# EAGLE design comparator (EAGLE 6.6.0)
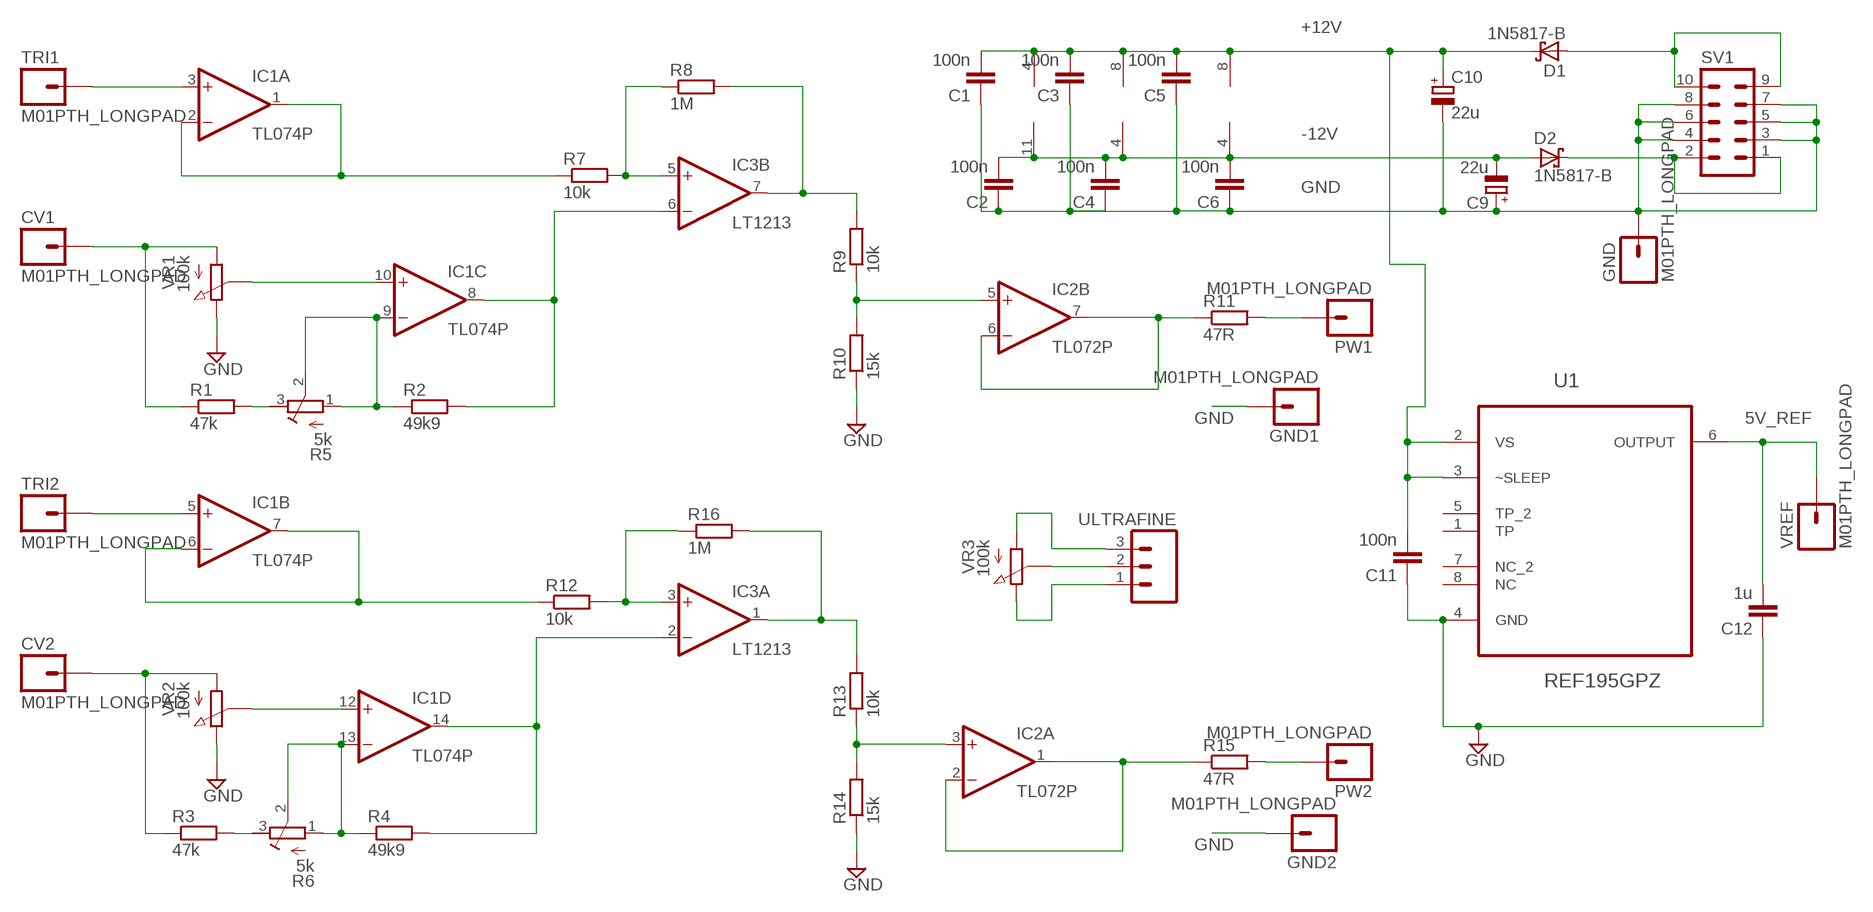
[diagram p0: schematic, sheet 1]

## Parts
C1  100n  C-EU025-025X050  [C025-025X050]
C2  100n  C-EU025-025X050  [C025-025X050]
C3  100n  C-EU025-025X050  [C025-025X050]
C4  100n  C-EU025-025X050  [C025-025X050]
C5  100n  C-EU025-025X050  [C025-025X050]
C6  100n  C-EU025-025X050  [C025-025X050]
C9  22u  CPOL-EUE2.5-5  [E2,5-5]
C10  22u  CPOL-EUE2.5-5  [E2,5-5]
C11  100n  C-EU025-025X050  [C025-025X050]
C12  1u  C-EU050-025X075  [C050-025X075]
CV1  M01PTH_LONGPAD  [1X01_LONGPAD]
CV2  M01PTH_LONGPAD  [1X01_LONGPAD]
D1  1N5817-B  [DO41-7.6]
D2  1N5817-B  [DO41-7.6]
GND  M01PTH_LONGPAD  [1X01_LONGPAD]
GND1  M01PTH_LONGPAD  [1X01_LONGPAD]
GND2  M01PTH_LONGPAD  [1X01_LONGPAD]
IC1  TL074P  [DIL14]
IC2  TL072P  [DIL08]
IC3  LT1213  TL072P  [DIL08]
PW1  M01PTH_LONGPAD  [1X01_LONGPAD]
PW2  M01PTH_LONGPAD  [1X01_LONGPAD]
R1  47k  MULTICOMP_MF25  [02.5-06.8/10]
R2  49k9  MULTICOMP_MF25  [02.5-06.8/10]
R3  47k  MULTICOMP_MF25  [02.5-06.8/10]
R4  49k9  MULTICOMP_MF25  [02.5-06.8/10]
R5  5k  R-TRIMM3296W  [RTRIM3296W]
R6  5k  R-TRIMM3296W  [RTRIM3296W]
R7  10k  MULTICOMP_MF25  [02.5-06.8/10]
R8  1M  MULTICOMP_MF25  [02.5-06.8/10]
R9  10k  MULTICOMP_MF25  [02.5-06.8/10]
R10  15k  MULTICOMP_MF25  [02.5-06.8/10]
R11  47R  MULTICOMP_MF25  [02.5-06.8/10]
R12  10k  MULTICOMP_MF25  [02.5-06.8/10]
R13  10k  MULTICOMP_MF25  [02.5-06.8/10]
R14  15k  MULTICOMP_MF25  [02.5-06.8/10]
R15  47R  MULTICOMP_MF25  [02.5-06.8/10]
R16  1M  MULTICOMP_MF25  [02.5-06.8/10]
SV1  10_PIN_HEADER  [MA05-2]
TRI1  M01PTH_LONGPAD  [1X01_LONGPAD]
TRI2  M01PTH_LONGPAD  [1X01_LONGPAD]
U1  REF195GPZ  [DIP254P762X533-8]
ULTRAFINE  M03LOCK  [1X03_LOCK]
VR1  100k  BI_P09X  [BI_9MM_SIDE]
VR2  100k  BI_P09X  [BI_9MM_SIDE]
VR3  100k  BI_P09X  [BI_9MM_SIDE]
VREF  M01PTH_LONGPAD  [1X01_LONGPAD]

## Nets
5V_REF: C12.2 U1.6(OUTPUT) VREF.1
+12V: C1.2 C3.2 C5.2 C10.+ C11.2 D1.C IC1.4(P:V+) IC2.8(P:V+) IC3.8(P:V+) U1.2(VS) U1.3(~SLEEP)
-12V: C2.2 C4.2 C6.2 C9.- D2.A IC1.11(P:V-) IC2.4(P:V-) IC3.4(P:V-)
GND: C1.1 C2.1 C3.1 C4.1 C5.1 C6.1 C9.+ C10.- C11.1 C12.1 GND1.1 GND2.1 GND.1 R10.P$1 R14.P$1 SV1.3 SV1.4 SV1.5 SV1.6 SV1.7 SV1.8 U1.4(GND) VR1.TOP VR2.TOP
N$1: IC1.3(A:+IN) TRI1.1
N$2: IC1.1(A:OUT) IC1.2(A:-IN) R7.P$1
N$3: IC3.5(B:+IN) R7.P$2 R8.P$1
N$5: PW1.1 R11.P$2
N$6: IC1.10(C:+IN) VR1.WIPER
N$7: R3.P$2 R6.3(A)
N$8: R1.P$2 R5.3(A)
N$9: IC1.9(C:-IN) R2.P$1 R5.1(E) R5.2(S)
N$10: IC1.8(C:OUT) IC3.6(B:-IN) R2.P$2
N$11: IC3.7(B:OUT) R8.P$2 R9.P$2
N$12: IC2.5(B:+IN) R9.P$1 R10.P$2
N$13: IC2.6(B:-IN) IC2.7(B:OUT) R11.P$1
N$14: IC3.3(A:+IN) R12.P$2 R16.P$1
N$15: IC1.5(B:+IN) TRI2.1
N$16: IC1.6(B:-IN) IC1.7(B:OUT) R12.P$1
N$18: IC1.12(D:+IN) VR2.WIPER
N$19: IC1.13(D:-IN) R4.P$1 R6.1(E) R6.2(S)
N$20: IC1.14(D:OUT) IC3.2(A:-IN) R4.P$2
N$21: IC3.1(A:OUT) R13.P$2 R16.P$2
N$22: IC2.3(A:+IN) R13.P$1 R14.P$2
N$23: IC2.1(A:OUT) IC2.2(A:-IN) R15.P$1
N$24: PW2.1 R15.P$2
N$26: ULTRAFINE.3 VR3.BOTTOM
N$27: ULTRAFINE.1 VR3.TOP
N$28: D1.A SV1.9 SV1.10
N$30: ULTRAFINE.2 VR3.WIPER
N$33: D2.C SV1.1 SV1.2
PW_CV1: CV1.1 R1.P$1 VR1.BOTTOM
PW_CV2: CV2.1 R3.P$1 VR2.BOTTOM
Unconnected: U1.1(TP) U1.5(TP_2) U1.7(NC_2) U1.8(NC)

## Library data of the parts
C1-C6 C11 C12 = resistor:C-EU: CAPACITOR, European symbol
C9 C10 = resistor:CPOL-EU: POLARIZED CAPACITOR, European symbol
CV1 CV2 GND GND1 GND2 PW1 PW2 TRI1 TRI2 VREF = SparkFun-Connectors:M01: Header 1 Standard 1-pin 0.1" header. Use with straight break away headers (SKU : PRT-00116), right angle break away headers (PRT-00553), swiss pins (PRT-00743), machine pins (PRT-00117), and female headers (PRT-00115).
D1 D2 = diode:1N581*: 1.0A SCHOTTKY BARRIER RECTIFIER Source: http://www.diodes.com/datasheets/ds23001.pdf
IC1 = linear:TL074: OP AMP
IC2 IC3 = linear:TL072: OP AMP
R1-R4 R7-R16 = resistors:MULTICOMP_MF25
R5 R6 = resistor:R-TRIMM: Trimm resistor
SV1 = TomW:10_PIN_HEADER: PIN HEADER; OC_FARNELL: unknown; OC_NEWARK: unknown
U1 = Vrefs:REF195GPZ: Precision Micropower Low Dropout Voltage References; MPN: REF195GPZ; OC_FARNELL: 1438681; OC_NEWARK: 19M9001; PACKAGE: PDIP-8; SUPPLIER: Analog Devices
ULTRAFINE = SparkFun-Connectors:M03: Header 3 Standard 3-pin 0.1" header. Use with straight break away headers (SKU : PRT-00116), right angle break away headers (PRT-00553), swiss pins (PRT-00743), machine pins (PRT-00117), and female headers (PRT-00115). Molex polarized connector foot print use with SKU : PRT-08232 with associated crimp pins and housings.
VR1-VR3 = potentiometers:BI_P09X: BI 9mm conductive plastic potentiometer right angled, single gang, 6mm shaft, bushing Mouser Part No: 858-P0915NEC15BR100K Manufacturer Part No: P0915N-EC15BR100K

## Board
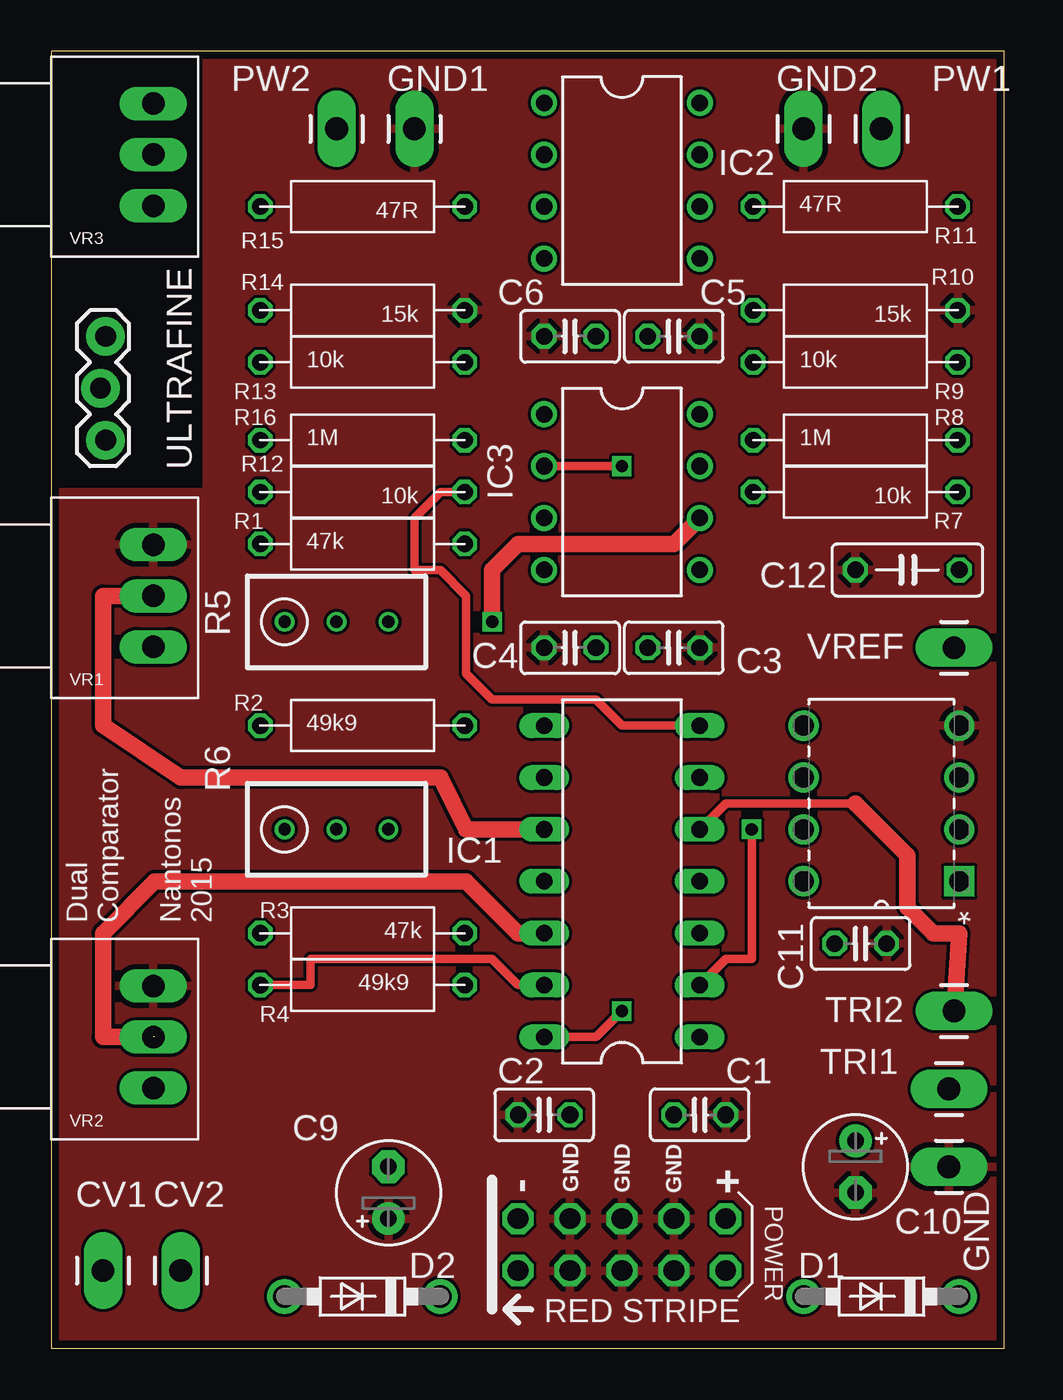
[diagram p1: board, top side]
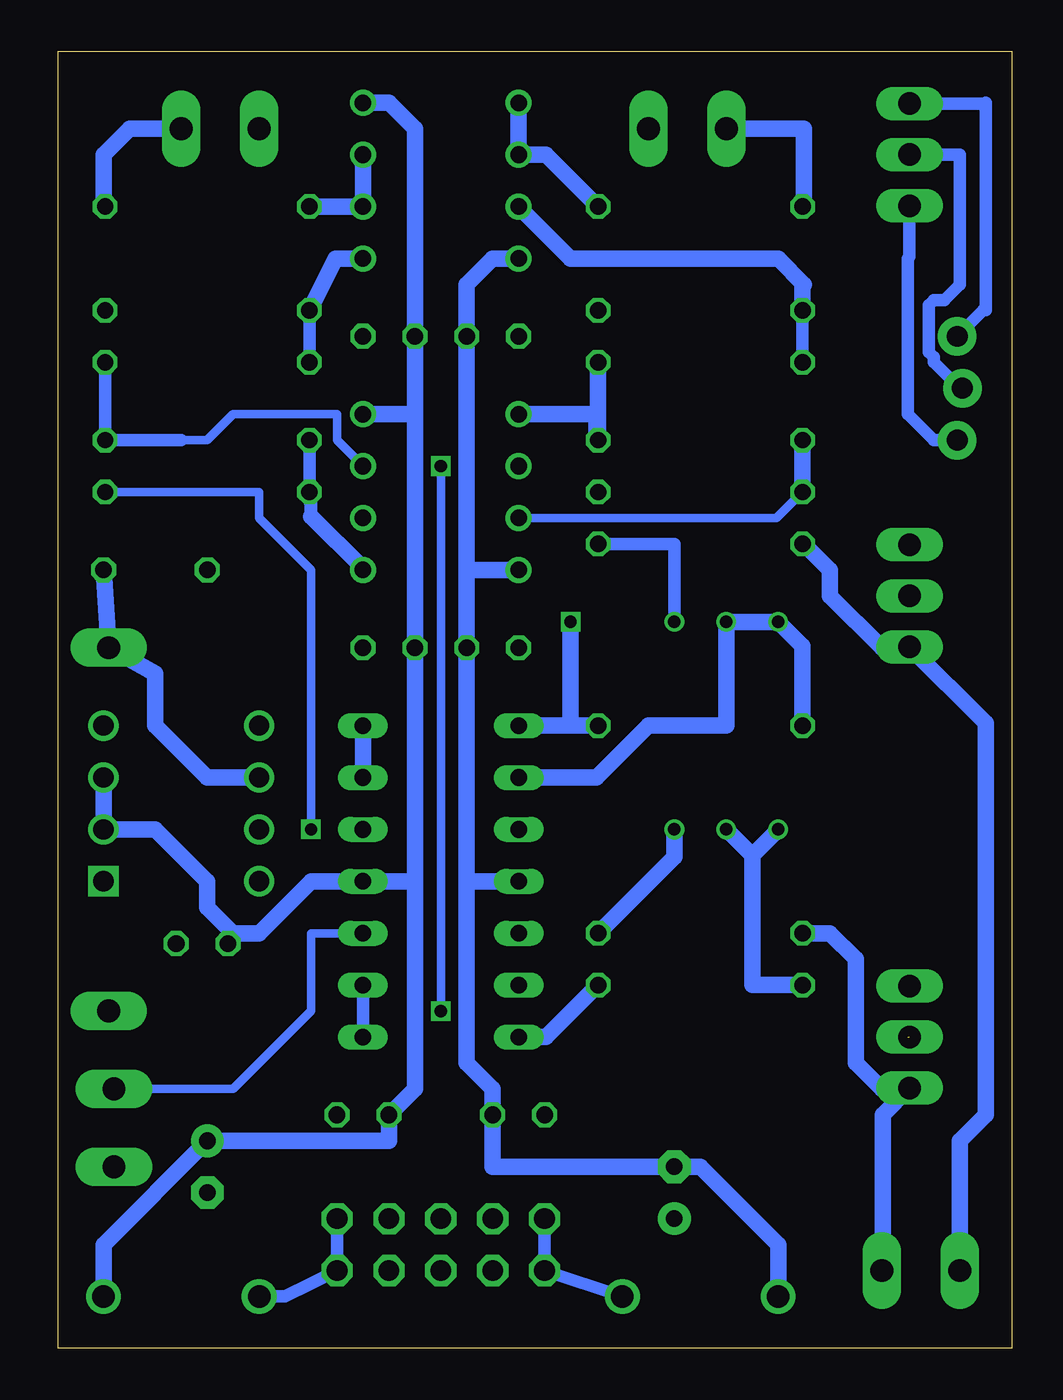
[diagram p2: board, bottom side, seen from below]

Size 46.66 x 63.49 mm. Coordinates in mm from the lower left corner, seen from the top.
Outline: 0,0 46.66,0 46.66,63.49 0,63.49 0,0
Copper layers (1*16): Top 0.0356mm / dielectric 1.5011mm / Bottom 0.0356mm
Design rules "oshpark-2layer": minimum track width 6mil, minimum drill 13mil, track to track 6mil, track to pad 6mil, pad to pad 6mil, via to via 6mil, smd to smd 6mil, copper to edge 15mil, drill to drill 6mil, minimum pad ring 7mil, minimum via ring 7mil, stop-mask expansion 4mil, vias tented up to drill 0mil, thermal gap 10mil

### Footprints (pad centres in the part's own frame; a part is rotated, then mirrored left to right if it is on the bottom)
C025-025X050 = drill 0.813 octagon: 1 -1.27,0; 2 1.27,0
E2,5-5 = drill 0.813 pad 1.6: + -1.27,0 | drill 0.813 pad 1.6 octagon: - 1.27,0
C050-025X075 = drill 0.813 octagon: 1 -2.54,0; 2 2.54,0
1X01_LONGPAD = drill 1.118 pad 1.88 long: 1 0,0
DO41-7.6 = drill 1.1 pad 1.7: A 3.81,0; C -3.81,0
DIL14 = drill 0.813 long: 1 -7.62,-3.81; 2 -5.08,-3.81; 3 -2.54,-3.81; 4 0,-3.81; 5 2.54,-3.81; 6 5.08,-3.81; 7 7.62,-3.81; 8 7.62,3.81; 9 5.08,3.81; 10 2.54,3.81; 11 0,3.81; 12 -2.54,3.81; 13 -5.08,3.81; 14 -7.62,3.81
DIL08 = drill 0.813 pad 1.27: 1 -3.81,-3.81; 2 -1.27,-3.81; 3 1.27,-3.81; 4 3.81,-3.81; 5 3.81,3.81; 6 1.27,3.81; 7 -1.27,3.81; 8 -3.81,3.81
02.5-06.8/10 = drill 0.8 octagon: P$1 -5,0; P$2 5,0
RTRIM3296W = drill 0.61: 1 0,-2.54; 2 0,0; 3 0,2.54
MA05-2 = drill 1.016 octagon: 1 -5.08,-1.27; 2 -5.08,1.27; 3 -2.54,-1.27; 4 -2.54,1.27; 5 0,-1.27; 6 0,1.27; 7 2.54,-1.27; 8 2.54,1.27; 9 5.08,-1.27; 10 5.08,1.27
DIP254P762X533-8 = drill 0.991 square: 1 -7.62,7.62 | drill 0.991: 2 -7.62,5.08; 3 -7.62,2.54; 4 -7.62,0; 5 0,0; 6 0,2.54; 7 0,5.08; 8 0,7.62
1X03_LOCK = drill 1.016 pad 1.88: 1 0,0.127; 2 2.54,-0.127; 3 5.08,0.127
BI_9MM_SIDE = drill 1.1 long: BOTTOM 5,-2.5; TOP 5,2.5; WIPER 5,0

### Placement (x,y rotation side)
C1  31.75,11.43 180 top
C2  24.13,11.43 0 top
C3  30.48,34.29 180 top
C4  25.4,34.29 0 top
C5  30.48,49.53 180 top
C6  25.4,49.53 0 top
C9  16.51,7.62 90 top
C10  39.37,8.89 270 top
C11  39.62,19.81 180 top
C12  41.91,38.1 0 top
CV1  2.54,3.81 0 top
CV2  6.35,3.81 0 top
D1  40.64,2.54 180 top
D2  15.24,2.54 180 top
GND  43.94,8.89 90 top
GND1  17.78,59.69 0 top
GND2  36.83,59.69 0 top
IC1  27.94,22.86 90 top
IC2  27.94,57.15 270 top
IC3  27.94,41.91 270 top
PW1  40.64,59.69 0 top
PW2  13.97,59.69 0 top
R1  15.24,39.37 0 top
R2  15.24,30.48 0 top
R3  15.24,20.32 0 top
R4  15.24,17.78 0 top
R5  13.97,35.56 270 top
R6  13.97,25.4 270 top
R7  39.37,41.91 180 top
R8  39.37,44.45 0 top
R9  39.37,48.26 0 top
R10  39.37,50.8 180 top
R11  39.37,55.88 0 top
R12  15.24,41.91 180 top
R13  15.24,48.26 0 top
R14  15.24,50.8 180 top
R15  15.24,55.88 180 top
R16  15.24,44.45 0 top
SV1  27.94,5.08 0 top
TRI1  43.94,12.7 90 top
TRI2  44.2,16.51 90 top
U1  36.83,30.48 180 top
ULTRAFINE  2.54,49.53 270 top
VR1  0,36.83 0 top
VR2  0,15.24 0 top
VR3  0,58.42 0 top
VREF  44.2,34.29 90 top

### Tracks (layer width: path | path; a pad name or v marks a point on that pad's centre or on a via)
5V_REF
  Bottom 0.61: U1.6 38.1,27.94
  Bottom 0.813: U1.6 39.37,27.94 41.91,30.48 41.91,33.02 VREF.1 C12.2
+12V
  Bottom 0.813: D1.C 44.45,5.08 C10.+ 30.48,10.16 C1.2 29.21,12.7 29.21,22.86 | 29.21,22.86 C3.2 29.21,45.72 | 29.21,22.86 IC1.4 34.29,22.86 36.83,20.32 38.1,20.32 | IC2.8 30.48,60.96 29.21,59.69 C5.2 29.21,45.72 | IC3.8 29.21,45.72 | U1.3 U1.2 41.91,25.4 39.37,22.86 39.37,21.59 38.1,20.32 | 38.1,20.32 38.1,20.07 C11.2
-12V
  Bottom 0.813: D2.A 11.43,5.08 15.24,8.89 C9.- 25.4,8.89 C2.2 25.4,12.7 26.67,13.97 26.67,22.86 | 26.67,22.86 C4.2 26.67,38.1 | 26.67,22.86 IC1.11 | IC2.4 25.4,53.34 26.67,52.07 C6.2 26.67,38.1 | IC3.4 26.67,38.1
GND
  pour Top: 7.62,63.5 46.99,63.5 46.99,0 0,0 0,41.91 7.62,41.91
N$1
  Bottom 0.406: IC1.3 34.29,20.32 34.29,16.51 38.1,12.7 TRI1.1
N$2  (via drill 0.6)
  Top 0.406: v34.29,25.4 34.29,19.05 33.02,19.05 IC1.2
  Bottom 0.406: R7.P$1 36.83,41.91 36.83,40.64 34.29,38.1 v34.29,25.4
  Bottom 0.61: IC1.2 IC1.1
N$3
  Bottom 0.61: R7.P$2 34.29,40.72 34.29,41.91 34.37,41.99 R8.P$1
  Bottom 0.813: IC3.5 31.75,38.18 34.29,40.72
N$5
  Bottom 0.813: R11.P$2 44.45,55.96 44.45,58.42 43.18,59.69 PW1.1
N$6
  Top 0.813: IC1.10 20.32,25.4 19.05,27.94 6.35,27.94 2.54,30.48 2.54,36.83 VR1.WIPER
N$7
  Bottom 0.813: R6.3 16.51,24.05 R3.P$2
N$8
  Bottom 0.61: R5.3 16.51,39.37 R1.P$2
N$9
  Bottom 0.813: R2.P$1 10.24,34.37 R5.1 R5.2 13.97,30.48 17.78,30.48 20.32,27.94 IC1.9
N$10  (via drill 0.6)
  Top 0.813: IC3.6 30.48,39.37 22.86,39.37 21.59,38.1 v21.59,35.56
  Bottom 0.813: v21.59,35.56 21.59,30.48 | 21.59,30.48 IC1.8 | R2.P$2 21.59,30.48
N$11
  Bottom 0.406: IC3.7 33.02,44.45 33.02,45.72 38.1,45.72 39.37,44.45 40.64,44.45
  Bottom 0.61: 40.64,44.45 R8.P$2 R9.P$2
N$12
  Bottom 0.61: R9.P$1 R10.P$2
  Bottom 0.813: IC2.5 33.1,53.34 R10.P$2
N$13
  Bottom 0.813: R11.P$1 IC2.6 IC2.7
N$14
  Bottom 0.406: IC3.3 11.51,40.64 R12.P$2
  Bottom 0.813: R16.P$1 R12.P$2
N$15
  Top 0.406: IC1.5 33.02,26.67 39.37,26.67
  Top 0.813: TRI2.1 44.45,20.32 43.18,20.32 41.91,21.59 41.91,24.13 39.37,26.67
N$16
  Top 0.406: IC1.7 27.94,30.48 26.67,31.75 21.59,31.75 20.32,33.02 20.32,36.83 19.05,38.1 17.78,38.1 17.78,40.64 19.05,41.91 R12.P$1
  Bottom 0.813: IC1.6 IC1.7
N$18  (1 unrouted)
  Top 0.813: IC1.12 22.86,20.32 20.32,22.86 5.08,22.86 2.54,20.32 2.54,15.24 5.08,15.24
N$19
  Top 0.406: IC1.13 22.86,17.78 21.59,19.05 12.7,19.05 12.7,17.78 R4.P$1
  Bottom 0.813: R4.P$1 12.7,17.78 12.7,24.13 | 12.7,24.13 R6.2 | R6.1 12.7,24.13
N$20  (via drill 0.6)
  Top 0.406: IC3.2 v27.94,43.18 | v27.94,16.51 26.67,15.24 IC1.14
  Bottom 0.406: v27.94,43.18 v27.94,16.51
  Bottom 0.813: IC1.14 22.78,15.24 R4.P$2
N$21
  Bottom 0.813: IC3.1 20.32,45.72 20.32,44.53 R16.P$2 R13.P$2
N$22
  Bottom 0.61: R14.P$2 R13.P$1
  Bottom 0.813: R14.P$2 10.24,51.99 10.16,52.07 11.43,53.34 21.59,53.34 IC2.3
N$23
  Bottom 0.813: IC2.1 IC2.2 22.78,58.42 R15.P$1
N$24
  Bottom 0.813: R15.P$2 10.16,55.96 10.16,59.69 PW2.1
N$26
  Bottom 0.61: VR3.BOTTOM 5,53.42 5.08,53.34 5.08,45.72 3.81,44.45 ULTRAFINE.3
N$27
  Bottom 0.61: VR3.TOP 1.31,60.92 1.27,60.96 1.27,50.8 1.4,50.8 ULTRAFINE.1
N$28
  Bottom 0.61: SV1.10 SV1.9 35.56,2.54 D1.A
N$30
  Bottom 0.61: VR3.WIPER 2.54,58.42 2.54,52.07 3.3,51.31 3.81,51.31 4.06,51.05 4.06,48.77 3.81,48.51 3.81,48.26 2.54,46.99 ULTRAFINE.2
N$33
  Bottom 0.61: SV1.2 SV1.1 D2.C
PW_CV1
  Bottom 0.813: R1.P$1 10.16,39.37 8.89,38.1 8.89,36.83 6.35,34.29 5.04,34.29 VR1.BOTTOM 1.27,30.6 1.27,11.43 2.54,10.16 CV1.1
PW_CV2
  Bottom 0.813: R3.P$1 8.89,20.32 7.62,19.05 7.62,13.97 6.35,12.7 5.04,12.7 VR2.BOTTOM 6.31,11.43 6.31,3.85 CV2.1

### Text on the board
tPlace: Dual / Comparator / / Nantonos / 2015